# Altium schematic sheet Fri3d_2024_Blaster_00.SchDoc: Blaster
size A3; Date: 11/03/2024; DrawnBy: Wim Van Gool; DocumentNumber: 1; Revision: 00; SheetNumber: 1; SheetTotal: 1
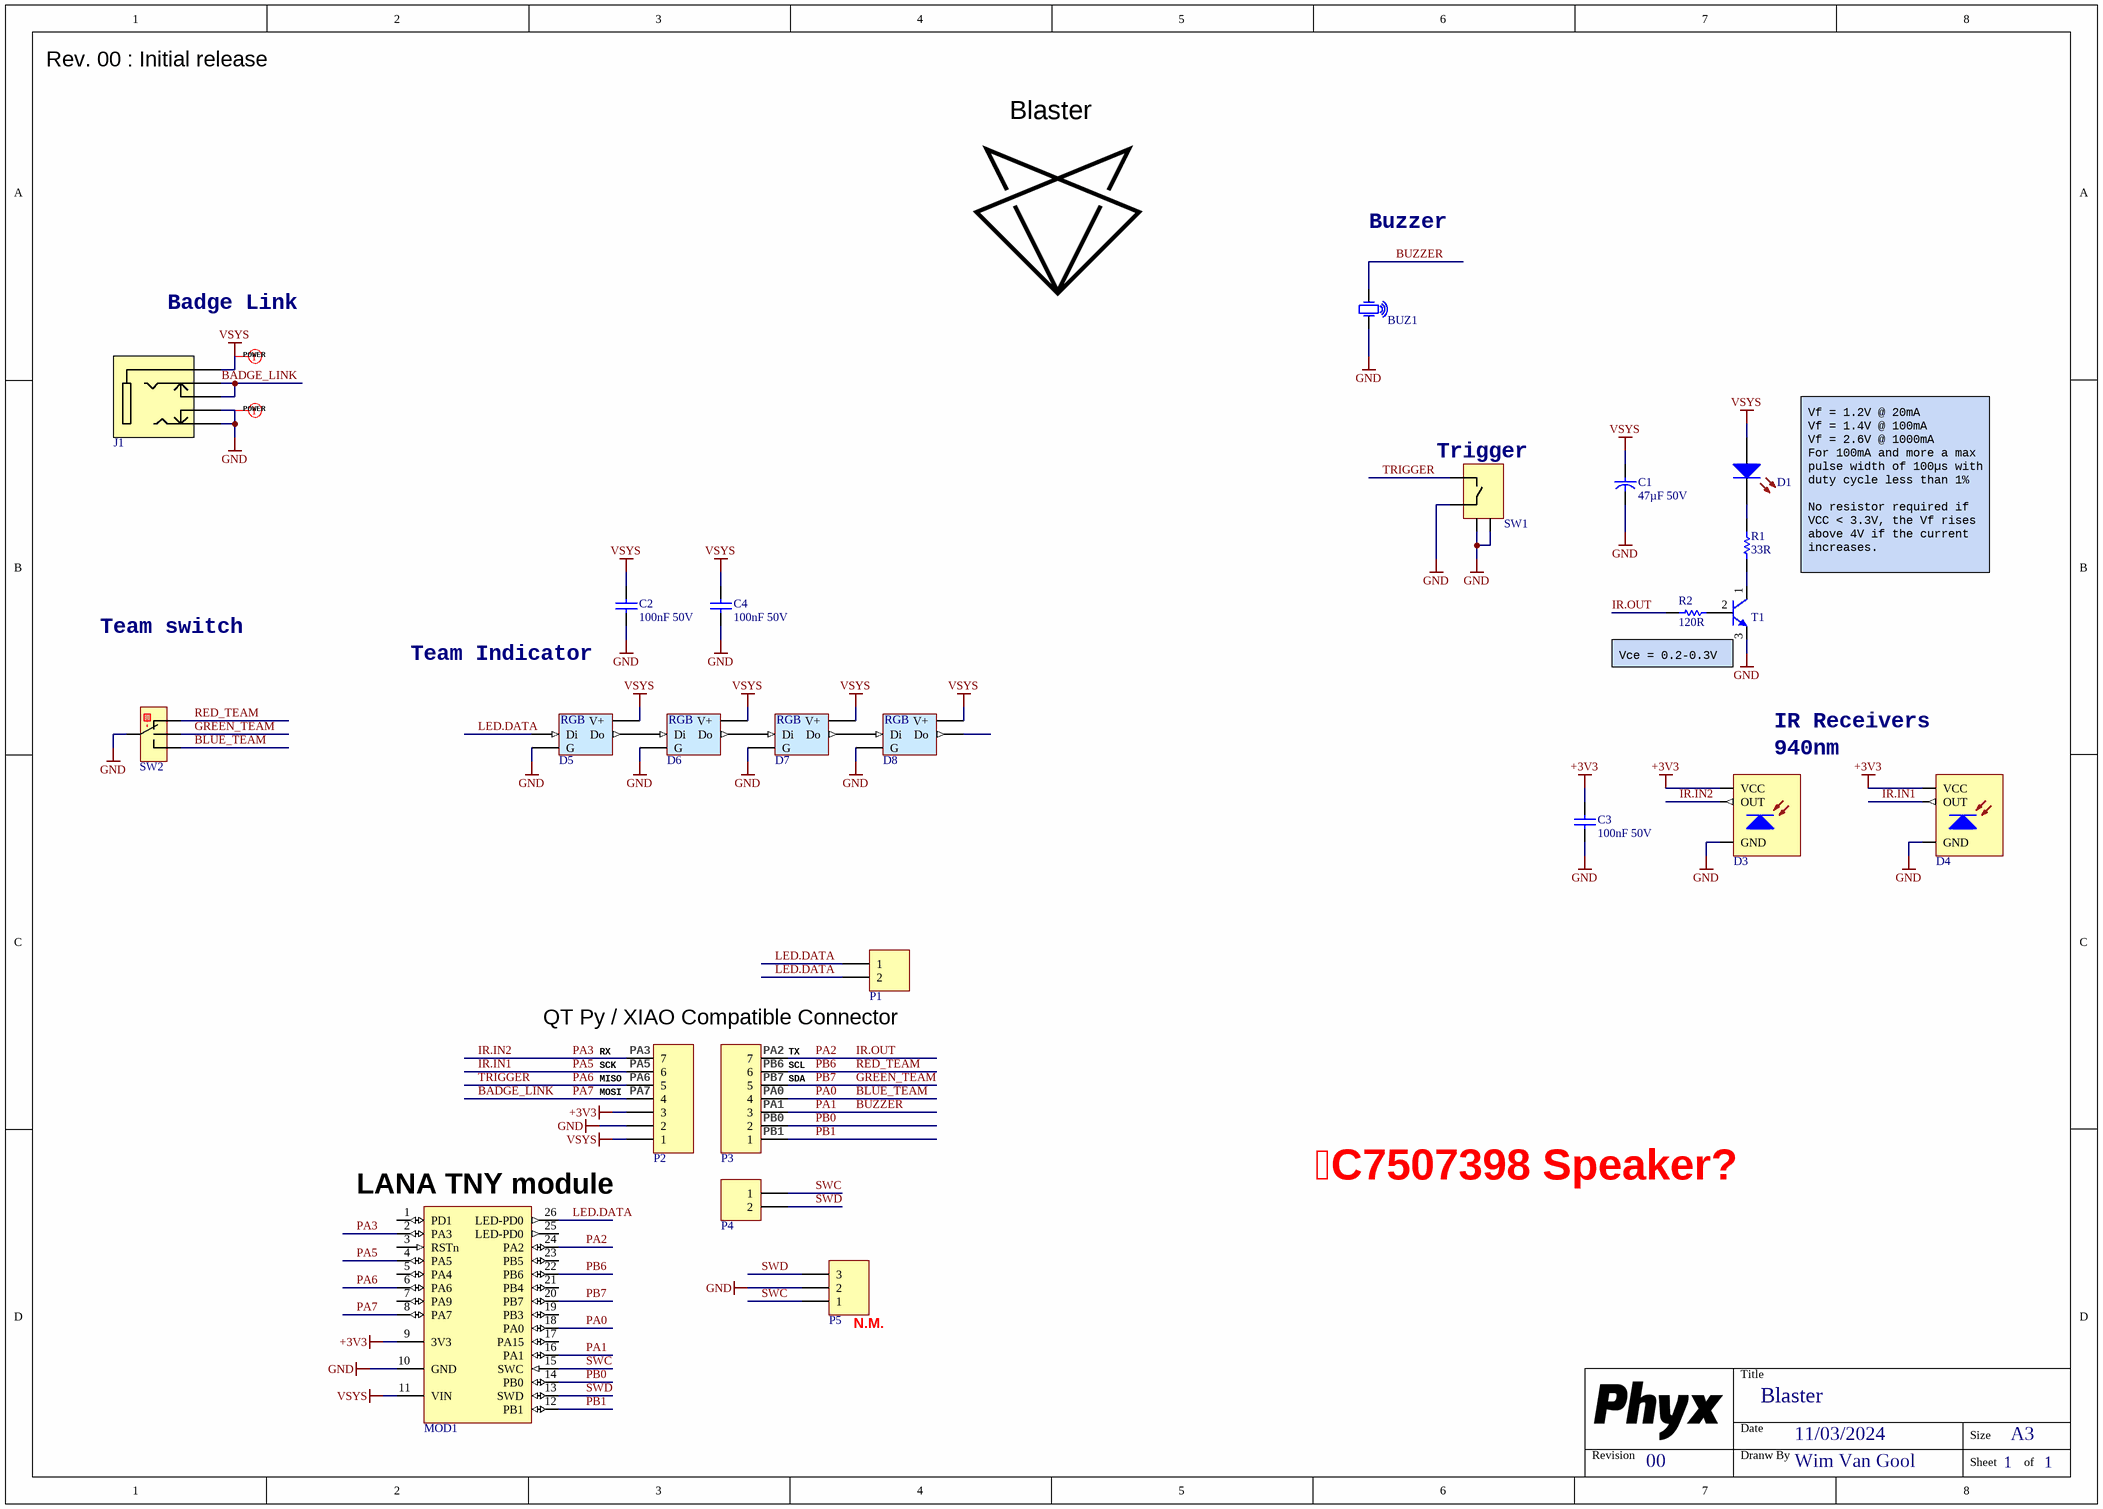
[diagram p0: Fri3d_2024_Blaster_00.SchDoc]

## Parts
BUZ1  14x14x7mm Piezo Buzzer Transducer 80dB  [CUI_CEP-1162]  (value not drawn)
C1  value 47µF 50V  [C_8x9_3.5mm]  (hidden comment: CAP_POL)
C2  value 100nF 50V  [C_5.08mm]  (hidden comment: CAP_CERAMIC)
C3  value 100nF 50V  [C_5.08mm]  (hidden comment: CAP_CERAMIC)
C4  value 100nF 50V  [C_5.08mm]  (hidden comment: CAP_CERAMIC)
D1  5mm IR LED, 940nm, 100mA, 1.35V, 25Deg  [LED_5MM_RD]  (value not drawn)
D3  IRM-3638N3F14 Infrared Receiver 38 kHz 45° 2.7-5.5V  [VIS_TSOP381x_BENT]  (value not drawn)
D4  IRM-3638N3F14 Infrared Receiver 38 kHz 45° 2.7-5.5V  [VIS_TSOP381x_BENT]  (value not drawn)
D5  WS2812 based digital RGB LED 4020 White package Side emitting  [LED_8mm_RGB_RA]  (value not drawn)
D6  WS2812 based digital RGB LED 4020 White package Side emitting  [LED_8mm_RGB_RA]  (value not drawn)
D7  WS2812 based digital RGB LED 4020 White package Side emitting  [LED_8mm_RGB_RA]  (value not drawn)
D8  WS2812 based digital RGB LED 4020 White package Side emitting  [LED_8mm_RGB_RA]  (value not drawn)
J1  3.5mm jack, dual switch, black, 3 contacts  [CUI_SJ1-3525NG]  (value not drawn)
MOD1  CH23V203 based TNY module  [PHYX_LANA_TNY_SMD]  (value not drawn)
P1  Header 2  [HDR1X2]  (value not drawn)
P2  Header 7  [HDR1X7]  (value not drawn)
P3  Header 7  [HDR1X7]  (value not drawn)
P4  Header 2  [HDR1X2]  (value not drawn)
P5  Header 3  [HDR1X3]  (value not drawn)
R1  value 33R  [RES_10mm]  (hidden comment: RESISTOR)
R2  value 120R  [RES_10mm]  (hidden comment: RESISTOR)
SW1  Tact switch, RA, 3,85mm  [TACTSW_RA_385]  (value not drawn)
SW2  1P3T SK13D07VG3 3mm post  [SK13D07VG3]  (value not drawn)
T1  0.2A 40V 100hfe NPN Transistor  [TO-92A_WIDE]  (value not drawn)

## Nets
+3V3: C3.1 D3.3(VCC) D4.3(VCC) MOD1.9(3V3) P2.3
GND: BUZ1.1(OSC1) C1.2 C2.2 C3.2 C4.2 D3.2(GND) D4.2(GND) D5.3(G) D6.3(G) D7.3(G) D8.3(G) J1.2(Tip) J1.4 MOD1.10(GND) P2.2 P5.2 SW1.2 SW1.MH1 SW1.MH2 SW2.3 T1.3(E)
VSYS: C1.1 C2.1 C4.1 D1.1(A) D5.2(V+) D6.2(V+) D7.2(V+) D8.2(V+) J1.1(Sleeve) MOD1.11(VIN) P2.1
BADGE_LINK: J1.3(Ring) J1.5 MOD1.8(PA7) P2.4  [also labelled PA7]
BLUE_TEAM: MOD1.18(PA0) P3.4 SW2.4  [also labelled PA0]
BUZZER: BUZ1.2(OSC2) MOD1.16(PA1) P3.3  [also labelled PA1]
GREEN_TEAM: MOD1.20(PB7) P3.5 SW2.2  [also labelled PB7]
IR.IN1: D4.1(OUT) MOD1.4(PA5) P2.6  [also labelled PA5]
IR.IN2: D3.1(OUT) MOD1.2(PA3) P2.7  [also labelled PA3]
IR.OUT: MOD1.24(PA2) P3.7 R2.2  [also labelled PA2]
LED.DATA: D5.4(Di) MOD1.26(LED-PD0) P1.1 P1.2
PA6: MOD1.6(PA6) P2.5 SW1.1  [also labelled TRIGGER]
PB0: MOD1.14(PB0) P3.2
PB1: MOD1.12(PB1) P3.1
PB6: MOD1.22(PB6) P3.6 SW2.1  [also labelled RED_TEAM]
SWC: MOD1.15(SWC) P4.1 P5.1
SWD: MOD1.13(SWD) P4.2 P5.3
NetD1_2: D1.2(K) R1.1
NetD5_1: D5.1(Do) D6.4(Di)
NetD6_1: D6.1(Do) D7.4(Di)
NetD7_1: D7.1(Do) D8.4(Di)
NetR1_2: R1.2 T1.1(C)
NetR2_1: R2.1 T1.2(B)

Not connected (* = marked no-connect by the designer): D8 1(Do); MOD1 1(PD1) 3(RSTn) 5(PA4) 7(PA9) 17(PA15) 19(PB3) 21(PB4) 23(PB5) 25(LED-PD0)

## Layout directives
net class POWER: GND, VSYS

## Notes on the sheet
- Rev. 00 : Initial release
- Buzzer
- Badge Link
- (near SW1) Trigger
- Vf = 1.2V @ 20mA
  Vf = 1.4V @ 100mA
  Vf = 2.6V @ 1000mA
  For 100mA and more a max pulse width of 100µs with duty cycle less than 1%
  No resistor required if VCC < 3.3V, the Vf rises above 4V if the current increases.
- Team switch
- Team Indicator
- (near T1) Vce = 0.2-0.3V
- IR Receivers
- (near D3) 940nm
- (near P2) RX
- (near P2) PA3
- QT Py / XIAO Compatible Connector
- (near P3) PA2
- (near P3) TX
- (near P2) MOSI
- (near P2) MISO
- (near P2) SCK
- (near P2) PA5
- (near P2) PA6
- (near P2) PA7
- (near P3) PB6
- (near P3) PB7
- (near P3) PA0
- (near P3) PA1
- (near P3) PB0
- (near P3) SCL
- (near P3) SDA
- (near MOD1) LANA TNY module
- (near P3) PB1
- C7507398 Speaker?
- (near P5) N.M.
- Title
- Revision
- Date
- Dranw By
- Size
- A3
- Sheet
- of
- (in symbol LED RGB WS2812 8mm) RGB

## Library data of the parts
BUZ1 = BUZ CUI CEP-1162: Crystal Oscillator; Value: CMT-1203-SMT; Supplier 1: Digi-key; Supplier Part Number 1: 102-1134-ND; Supplier 2: LCSC; Supplier Part Number 2: C360604
C1 = CAP 47µF 50V 8X9: Capacitor electrolyt; Supplier 1: LCSC; Supplier Part Number 1: C270004; Supplier Part Number 3: 47µF 50V 1% _8x9
C2-C4 = CAP 100nF 50V 5.08mm: Capacitor Ceramic; Supplier 1: LCSC; Supplier Part Number 1: C84772
D1 = LED IR 5mm TSAL6400: =Description; Value: TSAL6400; Supplier 1: Farnell; Supplier Part Number 1: 3152868; Supplier 2: LCSC; Supplier Part Number 2: C264290
D3 D4 = PHO IR Rx RA: =Description; Value: IRM-3638N3F14; Supplier 1: LCSC; Supplier Part Number 1: C264262
D5-D8 = LED RGB WS2812 8mm: =Description; Value: WS2812D-F8; Supplier 1: LCSC; Supplier Part Number 1: C139126
J1 = AUDIO JACK 3.5 3c SJ1-3525NG: =Description; Value: SJ1-3525NG; Supplier 1: Digi-key; Supplier Part Number 1: CP1-3525NG-ND
MOD1 = MOD # CH23V203 LANA TNY SMD: Value: LANA TNY; Supplier 1: Phyx; Supplier Part Number 1: LANA TNY
P1 P4 = Pin Header 2.54mm 2way: Supplier 1: LCSC; Supplier Part Number 1: C492401; Supplier 2: LCSC; Supplier Part Number 2: C541856
P2 P3 = Pin Header 2.54mm 7way
P5 = Pin Header 2.54mm 3way: Supplier 1: LCSC; Supplier Part Number 1: C429954; Supplier 2: LCSC; Supplier Part Number 2: C49257
R1 = RES 33R 1/4W: Supplier 1: LCSC; Supplier Part Number 1: C173006; Supplier 3: Generic; Supplier Part Number 3: 33R 1/4W 1% TH 10mm
R2 = RES 120R 1/4W: Supplier 1: LCSC; Supplier Part Number 1: C58684; Supplier 3: Generic; Supplier Part Number 3: 120R 1/4W 1% TH 10mm
SW1 = SW TACT RA 3,85mm 431256038716: Value: 431256038716; Supplier 1: Wurth; Supplier Part Number 1: 431256038716; Supplier 2: Mouser; Supplier Part Number 2: 710-431256038716
SW2 = SW Slide SP3T SK13D07VG3: Value: SK13D07VG3; Supplier 1: LCSC; Supplier Part Number 1: C2681580
T1 = 2N3904 NPN 0.2A: Value: 2N3904; Supplier 1: Farnell; Supplier Part Number 1: 1700648; Supplier 2: LCSC; Supplier Part Number 2: C118538